# Altium schematic sheet Sheet1.SchDoc
size A4; SheetNumber: 1; SheetTotal: 1
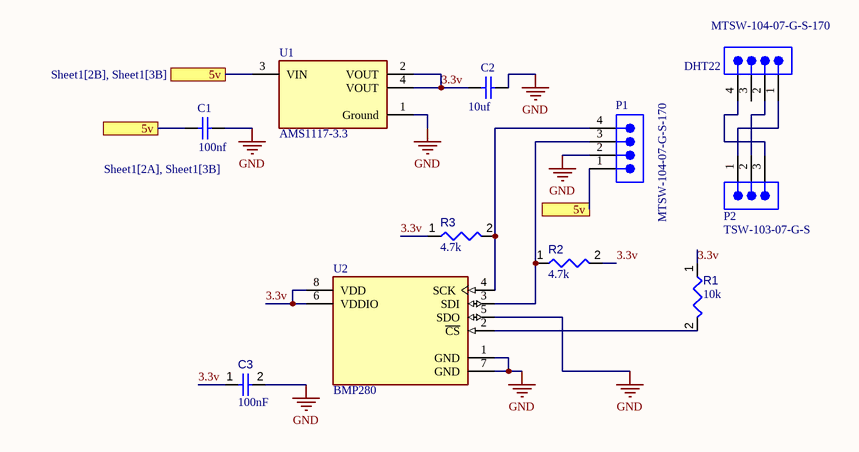
[diagram p0: Sheet1.SchDoc]

## Parts
C1  100nf  [CAPC2013X135X50ML15T20]
C2  10uf  [CAPC2013X140X50ML20T25]
C3  value 100nF  [CAPC2013X95X50LL10T25]  (hidden comment: Capacitor 100 nF +/-10% 50 V 0805)
DHT22  MTSW-104-07-G-S-170  [SMTC-MTSW-104-07-X-S-170]
P1  MTSW-104-07-G-S-170  [SMTC-MTSW-104-07-X-S-170]
P2  TSW-103-07-G-S  [SMTC-TSW-103-07-X-S]
R1  value 10k  [RESC2013X50X35ML15T15]  (hidden comment: Resistor 10k +/-1% 0805 125 mW)
R2  value 4.7k  [RESC2013X70X40ML20T20]  (hidden comment: Resistor 4k7 +/-1% 0805 125 mW)
R3  value 4.7k  [RESC2013X70X40ML20T20]  (hidden comment: Resistor 4k7 +/-1% 0805 125 mW)
U1  AMS1117-3.3  [FP-AMS1117-IPC_C]
U2  BMP280  [FP-BMP280-MFG]

## Ports
5v, 5v (see Sheet1[2A], Sheet1[3B]), 5v (see Sheet1[2B], Sheet1[3B])

## Nets
GND: C1.2 C2.1 C3.2 P1.2 U1.1(Ground) U2.1(GND) U2.5(SDO) U2.7(GND)
3.3v: C2.2 C3.1 R1.1 R2.2 R3.1 U1.2(VOUT) U1.4(VOUT) U2.6(VDDIO) U2.8(VDD)
5v: C1.1 P1.1 U1.3(VIN) ; port 5v
NetDHT22_1: DHT22.1 P2.1
NetDHT22_2: DHT22.2 P2.2
NetDHT22_4: DHT22.4 P2.3
NetP1_3: P1.3 R2.1 U2.3(SDI)
NetP1_4: P1.4 R3.2 U2.4(SCK)
NetR1_2: R1.2 U2.2(~{CS})

Not connected (* = marked no-connect by the designer): DHT22 3

## Library data of the parts
C1 = CMP-2007-03440-1: Manufacturer: Vitramon; Part Number: VJ0805Y104KXATW1BC
C2 = CMP-2007-04644-1: Part Number: 08056D106KAT4A; Manufacturer: AVX Interconnect / Elco
C3 = CMP-001-00018-6: Chip Capacitor, 100 nF, +/- 10%, 50 V, 0805 (2012 Metric); Capacitor Type: Ceramic; Voltage Rating: 50V; Pins: 2; Max Operating Temperature: 125°C; Min Operating Temperature: -55°C; Mounting Technology: SM; Case/Package: 0805; RoHS Compliant: True; Tolerance: 10%
DHT22 P1 = CMP-1024-00104-1: Modified .025" SQ Post Header, Through-hole, Vertical, -55 to 125 degC, 2.54 mm Pitch, 4-Pin, Male, RoHS; Manufacturer: Samtec; Pitch: 2.54 mm; Temperature Range: -55 to 125 degC; ComponentLink1URL: http://www.samtec.com; ComponentLink1Description: Manufacturer URL; ComponentLink3URL: http://www.samtec.com/documents/webfiles/cpdf/MTSW-XXX-XX-X-X-XXXX-XX-XXX-MKT1.pdf; DatasheetVersion: F-214; Orientation: Vertical; ComponentLink3Description: Package Specification; PackageReference: MTSW-104-07-X-S-170; PackageDescription: Assembly .025" [.64] SQ Post Terminal Strip; ComponentLink2Description: Datasheet; PackageVersion: BI, 2/1987; ComponentLink2URL: http://www.samtec.com/documents/webfiles/pdf/MTSW.PDF; PartNumber: MTSW-104-07-G-S-170; Mounting Technology: Through-hole; RoHS: True
P2 = CMP-1024-00333-1: 0.025" SQ Post Header, Through-hole, Vertical, -55 to 125 degC, 2.54 mm Pitch, 3-Pin, Male, RoHS; Manufacturer: Samtec; Pitch: 2.54 mm; ComponentLink3URL: http://www.samtec.com/documents/webfiles/cpdf/TSW-XXX-XX-XXX-X-XX-XXX-MKT.pdf; Temperature Range: -55 to 125 degC; DatasheetVersion: F-214; ComponentLink1Description: Manufacturer URL; ComponentLink2URL: http://www.samtec.com/documents/webfiles/pdf/TSW_TH.PDF; RoHS: True; Orientation: Vertical; ComponentLink2Description: Datasheet; ComponentLink3Description: Package Specification; PackageDescription: .025[0.64] SQ. Post Terminal Strip Assembly; Mounting Technology: Through-hole; PackageVersion: DM, 8/1988; ComponentLink1URL: http://www.samtec.com; PackageReference: TSW-103-07-X-S; PartNumber: TSW-103-07-G-S
R1 = CMP-009-00018-5: Chip Resistor, 10 KOhm, +/- 1%, 125 mW, -55 to 155 degC, 0805 (2012 Metric); Power: 125mW; Voltage Rating: 150V; Tolerance: 1%; Pins: 2; Min Operating Temperature: -55°C; Case/Package: 0805; Max Operating Temperature: 155°C; RoHS Compliant: True; Mounting Technology: SM
R2 R3 = CMP-009-00032-5: Chip Resistor, 4.7 KOhm, +/- 1%, 0.125 W, -55 to 155 degC, 0805 (2012 Metric); Power: 125mW; Voltage Rating: 150V; Max Operating Temperature: 155°C; Min Operating Temperature: -55°C; Case/Package: 0805; RoHS Compliant: True; Pins: 2; Tolerance: 1%; Mounting Technology: SM
U1 = CMP-209535-000001-1: LDO Voltage Regulators 1A, 3.3V; Manufacturer: Advanced Monolithic Systems; Dropout Voltage: 1.1V; Output Type: Fixed; Nominal Supply Current: 5mA; Max Power Dissipation: 1.2W; Max Supply Voltage: 15V; Number Of Outputs: 1; Standoff Height: 0.64mm; Max Junction Temp: +125°C; Height: 1.8mm; Package: AMS1117; Device Class L2: Power Management ICs; ComponentLink2Description: Datasheet; ComponentLink2URL: http://www.advanced-monolithic.com/pdf/ds1117.pdf; Category: IC; RoHS: TRUE; Automotive: No; Device Class L1: Integrated Circuits (ICs); Output Current: 1A; Device Class L3: Voltage Regulators - Linear; Temperature: -40°C to +125°C; Output Voltage: 3.3V; Manufacturer Part Number: AMS1117-3.3; Temperature Range Low: -40°C; Octopart: https://octopart.com/ams1117-3.3-advanced+monolithic+systems-25899300; Lead Free: Yes; Ipc Land Pattern Name: SOT229P700X180-4; Temperature Range High: +125°C
U2 = CMP-2000-05076-3: SENSOR PRESSURE ABS; Operating Pressure: 15.95PSI; Pressure Type: Absolute; Output Type: SPI; Max Pressure: 290.08PSI; Port Style: No Port; Case/Package: SMD/SMT; Lead Free: Lead Free; Termination: SMD/SMT; Min Operating Temperature: -40°C; Number of Pins: 8; Max Operating Temperature: 85°C